# Altium project AVR64DA64-BREAKOUT.PrjPcb
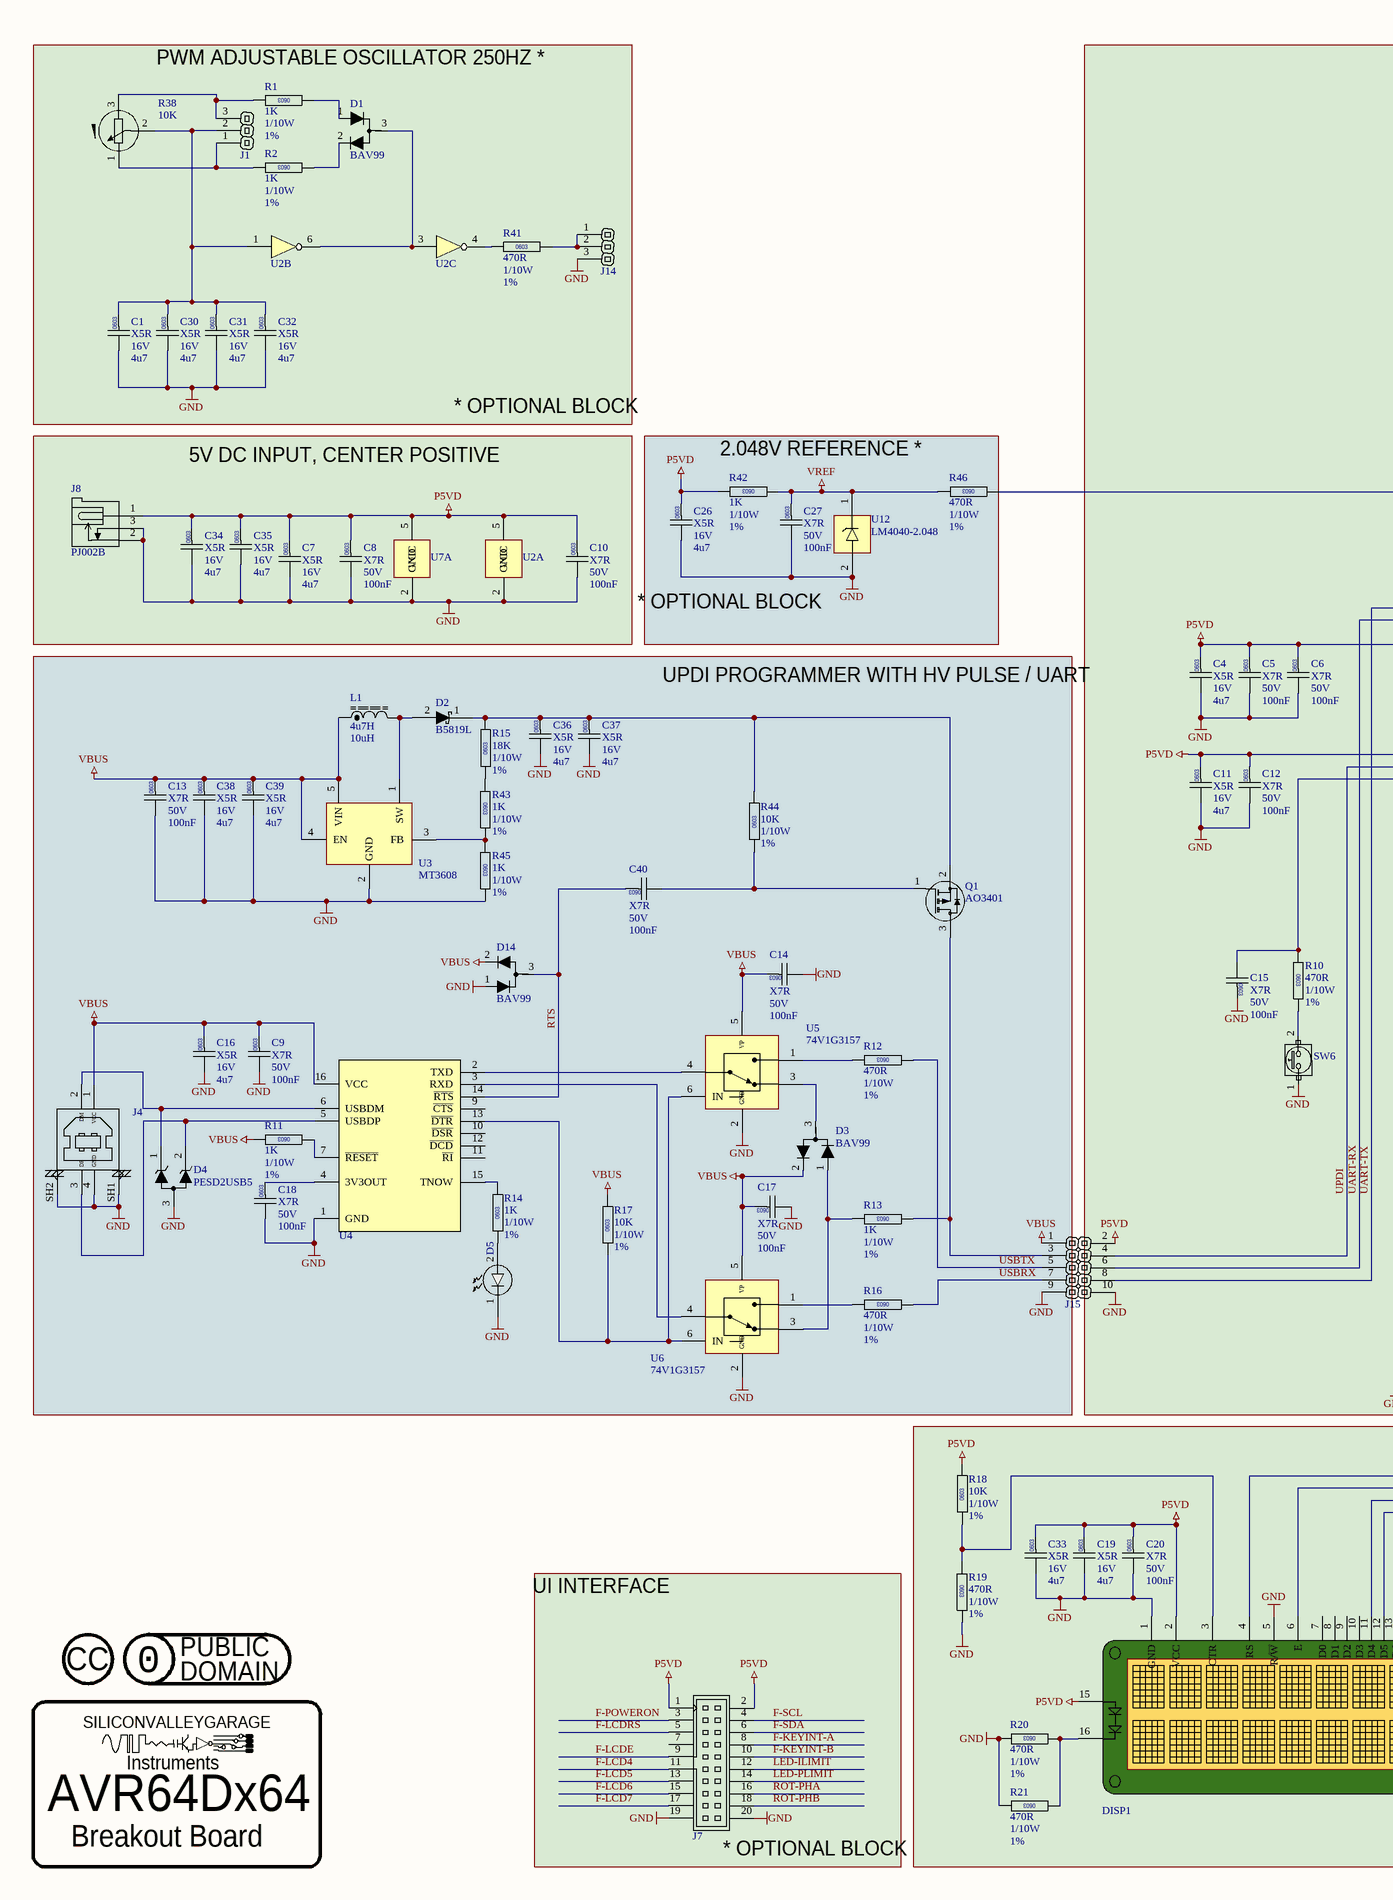
[diagram p0: AVR64DA64-BREAKOUT.SchDoc, left]
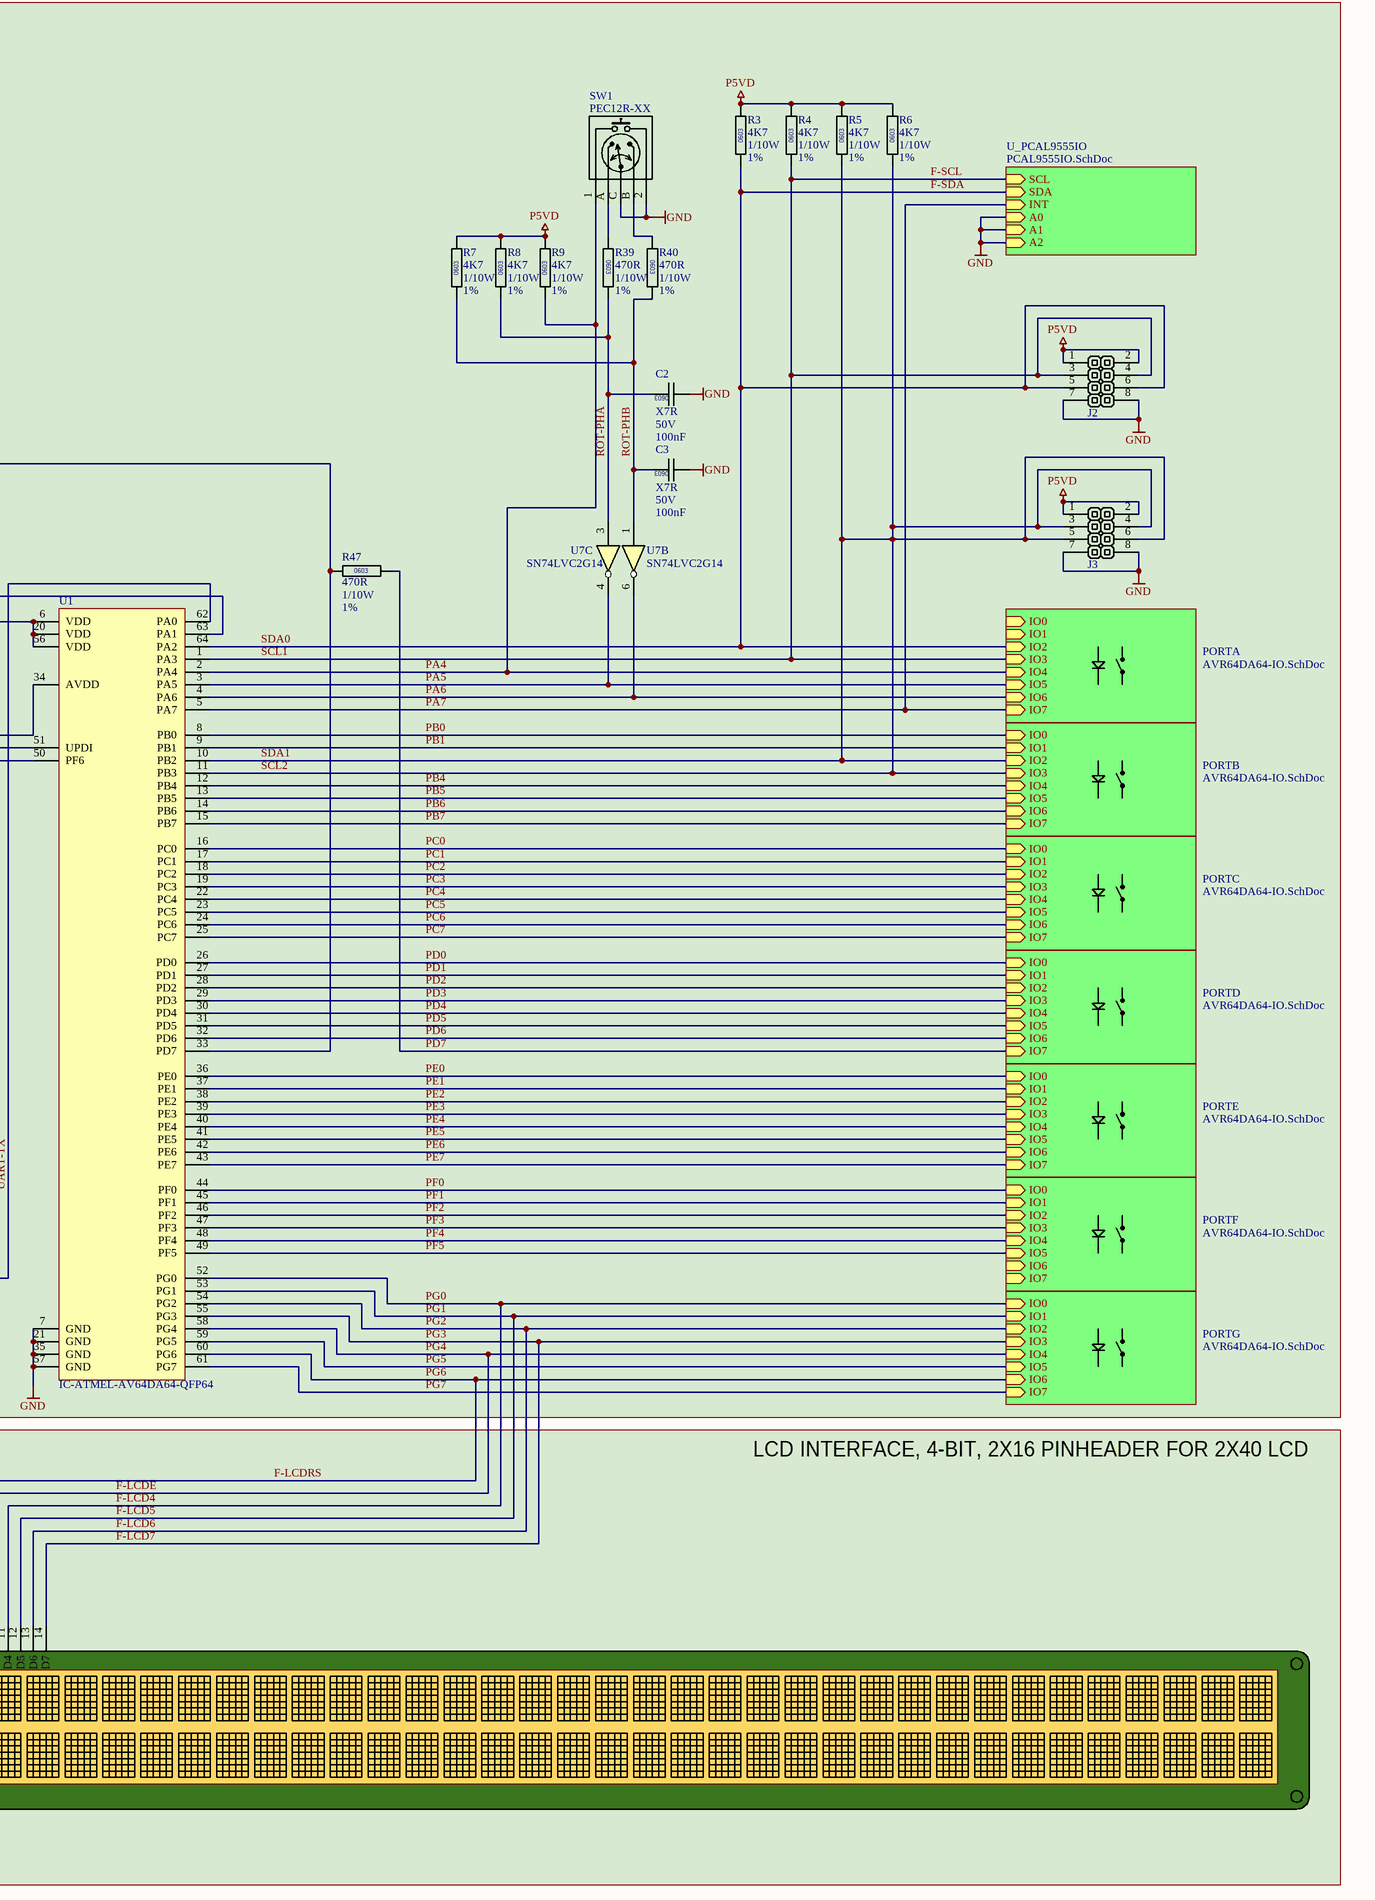
[diagram p1: AVR64DA64-BREAKOUT.SchDoc, right]
SCHdrafter: Vincent Himpe
3 sheets, 461 parts. Net scope: hierarchical (ports join the sheet entries above them; power ports are global).
Board file: AVR64DA64-BREAKOUT.PcbDoc
Sheets:
  AVR64DA64-BREAKOUT.SchDoc
    PORTA = AVR64DA64-IO.SchDoc
    PORTB = AVR64DA64-IO.SchDoc
    PORTC = AVR64DA64-IO.SchDoc
    PORTG = AVR64DA64-IO.SchDoc
    PORTF = AVR64DA64-IO.SchDoc
    PORTD = AVR64DA64-IO.SchDoc
    PORTE = AVR64DA64-IO.SchDoc
    U_PCAL9555IO = PCAL9555IO.SchDoc
      PCAL0 = AVR64DA64-IO.SchDoc
      PCAL1 = AVR64DA64-IO.SchDoc

## Sheet AVR64DA64-BREAKOUT.SchDoc
size A2; SheetNumber: 1; SheetTotal: 3

### Parts
(Parts that share a designator on the sheet are numbered #1, #2 ... from top to bottom, then left to right.)
C1  Dielectric: X5R  Voltage: 16V  Capacitance: 4u7  [CAPC0603]  (hidden comment: CAP0603)
C2  Dielectric: X7R  Voltage: 50V  Capacitance: 100nF  [CAPC0603]  (hidden comment: CAP0603)
C3  Dielectric: X7R  Voltage: 50V  Capacitance: 100nF  [CAPC0603]  (hidden comment: CAP0603)
C4  Dielectric: X5R  Voltage: 16V  Capacitance: 4u7  [CAPC0603]  (hidden comment: CAP0603)
C5  Dielectric: X7R  Voltage: 50V  Capacitance: 100nF  [CAPC0603]  (hidden comment: CAP0603)
C6  Dielectric: X7R  Voltage: 50V  Capacitance: 100nF  [CAPC0603]  (hidden comment: CAP0603)
C7  Dielectric: X5R  Voltage: 16V  Capacitance: 4u7  [CAPC0603]  (hidden comment: CAP0603)
C8  Dielectric: X7R  Voltage: 50V  Capacitance: 100nF  [CAPC0603]  (hidden comment: CAP0603)
C9  Dielectric: X7R  Voltage: 50V  Capacitance: 100nF  [CAPC0603]  (hidden comment: CAP0603)
C10  Dielectric: X7R  Voltage: 50V  Capacitance: 100nF  [CAPC0603]  (hidden comment: CAP0603)
C11  Dielectric: X5R  Voltage: 16V  Capacitance: 4u7  [CAPC0603]  (hidden comment: CAP0603)
C12  Dielectric: X7R  Voltage: 50V  Capacitance: 100nF  [CAPC0603]  (hidden comment: CAP0603)
C13  Dielectric: X7R  Voltage: 50V  Capacitance: 100nF  [CAPC0603]  (hidden comment: CAP0603)
C14  Dielectric: X7R  Voltage: 50V  Capacitance: 100nF  [CAPC0603]  (hidden comment: CAP0603)
C15  Dielectric: X7R  Voltage: 50V  Capacitance: 100nF  [CAPC0603]  (hidden comment: CAP0603)
C16  Dielectric: X5R  Voltage: 16V  Capacitance: 4u7  [CAPC0603]  (hidden comment: CAP0603)
C17  Dielectric: X7R  Voltage: 50V  Capacitance: 100nF  [CAPC0603]  (hidden comment: CAP0603)
C18  Dielectric: X7R  Voltage: 50V  Capacitance: 100nF  [CAPC0603]  (hidden comment: CAP0603)
C19  Dielectric: X5R  Voltage: 16V  Capacitance: 4u7  [CAPC0603]  (hidden comment: CAP0603)
C20  Dielectric: X7R  Voltage: 50V  Capacitance: 100nF  [CAPC0603]  (hidden comment: CAP0603)
C26  Dielectric: X5R  Voltage: 16V  Capacitance: 4u7  [CAPC0603]  (hidden comment: CAP0603)
C27  Dielectric: X7R  Voltage: 50V  Capacitance: 100nF  [CAPC0603]  (hidden comment: CAP0603)
C30  Dielectric: X5R  Voltage: 16V  Capacitance: 4u7  [CAPC0603]  (hidden comment: CAP0603)
C31  Dielectric: X5R  Voltage: 16V  Capacitance: 4u7  [CAPC0603]  (hidden comment: CAP0603)
C32  Dielectric: X5R  Voltage: 16V  Capacitance: 4u7  [CAPC0603]  (hidden comment: CAP0603)
C33  Dielectric: X5R  Voltage: 16V  Capacitance: 4u7  [CAPC0603]  (hidden comment: CAP0603)
C34  Dielectric: X5R  Voltage: 16V  Capacitance: 4u7  [CAPC0603]  (hidden comment: CAP0603)
C35  Dielectric: X5R  Voltage: 16V  Capacitance: 4u7  [CAPC0603]  (hidden comment: CAP0603)
C36  Dielectric: X5R  Voltage: 16V  Capacitance: 4u7  [CAPC0603]  (hidden comment: CAP0603)
C37  Dielectric: X5R  Voltage: 16V  Capacitance: 4u7  [CAPC0603]  (hidden comment: CAP0603)
C38  Dielectric: X5R  Voltage: 16V  Capacitance: 4u7  [CAPC0603]  (hidden comment: CAP0603)
C39  Dielectric: X5R  Voltage: 16V  Capacitance: 4u7  [CAPC0603]  (hidden comment: CAP0603)
C40  Dielectric: X7R  Voltage: 50V  Capacitance: 100nF  [CAPC0603]  (hidden comment: CAP0603)
D1  BAV99  [SOT23]
D2  B5819L  [SOD123]
D3  BAV99  [SOT23]
D4  PESD2USB5  [SOT23]
D5  KT-0603W  [LED-0603-GREEN]  (value not drawn)
D14  BAV99  [SOT23]
DISP1  DISPLAY-LCD-2X40  [CONNECTOR-GENERIC-BOXHEADER-2X8]  (value not drawn)
J1  BOXHEADER-2X4  [HEADER-GENERIC-MALE-1X3]  (value not drawn)
J2  BOXHEADER-2X4  [CONNECTOR-GENERIC-PINHEADER-2X4]  (value not drawn)
J3  BOXHEADER-2X4  [CONNECTOR-GENERIC-PINHEADER-2X4]  (value not drawn)
J4  CONN-CUI-UJ2-BH-BL1-TH  [CONN-CUI-UJ2-BH-BL1-TH]  (value not drawn)
J7  BOXHEADER-10X2  [CONNECTOR GENERIC-BOXHEADER-2X10]  (value not drawn)
J8  PJ002B  [CONN-CUI-PJ-002B]
J14  BOXHEADER-2X4  [HEADER-GENERIC-MALE-1X3]  (value not drawn)
J15  BOXHEADER-3X2  [CONNECTOR-GENERIC-PINHEADER-2X5]  (value not drawn)
L1  10uH  value 4u7H  [CAPC0603]
LOGO?#1  LOGO-LICENSE-CC  [LOGO-LICENSE-CC]  (value not drawn)  (no BOM)
LOGO?#2  LOGO-LICENSE-CC0-PUBLIC  [LOGO-LICENSE-CC0-PUBLIC]  (value not drawn)  (no BOM)
LOGO?#3  LOGO-SILICONVALLEYGARAGE-SMALL  [SILICONVALLEYGARAGE]  (value not drawn)  (graphical)
Q1  AO3401  [SOT23]
R1  value 1K  Power: 1/10W  Tolerance: 1%  [RESC0603]  (hidden comment: RESC0603)
R2  value 1K  Power: 1/10W  Tolerance: 1%  [RESC0603]  (hidden comment: RESC0603)
R3  value 4K7  Power: 1/10W  Tolerance: 1%  [RESC0603]  (hidden comment: RESC0603)
R4  value 4K7  Power: 1/10W  Tolerance: 1%  [RESC0603]  (hidden comment: RESC0603)
R5  value 4K7  Power: 1/10W  Tolerance: 1%  [RESC0603]  (hidden comment: RESC0603)
R6  value 4K7  Power: 1/10W  Tolerance: 1%  [RESC0603]  (hidden comment: RESC0603)
R7  value 4K7  Power: 1/10W  Tolerance: 1%  [RESC0603]  (hidden comment: RESC0603)
R8  value 4K7  Power: 1/10W  Tolerance: 1%  [RESC0603]  (hidden comment: RESC0603)
R9  value 4K7  Power: 1/10W  Tolerance: 1%  [RESC0603]  (hidden comment: RESC0603)
R10  value 470R  Power: 1/10W  Tolerance: 1%  [RESC0603]  (hidden comment: RESC0603)
R11  value 1K  Power: 1/10W  Tolerance: 1%  [RESC0603]  (hidden comment: RESC0603)
R12  value 470R  Power: 1/10W  Tolerance: 1%  [RESC0603]  (hidden comment: RESC0603)
R13  value 1K  Power: 1/10W  Tolerance: 1%  [RESC0603]  (hidden comment: RESC0603)
R14  value 1K  Power: 1/10W  Tolerance: 1%  [RESC0603]  (hidden comment: RESC0603)
R15  value 18K  Power: 1/10W  Tolerance: 1%  [RESC0603]  (hidden comment: RESC0603)
R16  value 470R  Power: 1/10W  Tolerance: 1%  [RESC0603]  (hidden comment: RESC0603)
R17  value 10K  Power: 1/10W  Tolerance: 1%  [RESC0603]  (hidden comment: RESC0603)
R18  value 10K  Power: 1/10W  Tolerance: 1%  [RESC0603]  (hidden comment: RESC0603)
R19  value 470R  Power: 1/10W  Tolerance: 1%  [RESC0603]  (hidden comment: RESC0603)
R20  value 470R  Power: 1/10W  Tolerance: 1%  [RESC0603]  (hidden comment: RESC0603)
R21  value 470R  Power: 1/10W  Tolerance: 1%  [RESC0603]  (hidden comment: RESC0603)
R38  value 10K  [POTMETER-PTV09A-4015F-BXXX]  (hidden comment: POTMETER-PTV09A-4015F-B103)
R39  value 470R  Power: 1/10W  Tolerance: 1%  [RESC0603]  (hidden comment: RESC0603)
R40  value 470R  Power: 1/10W  Tolerance: 1%  [RESC0603]  (hidden comment: RESC0603)
R41  value 470R  Power: 1/10W  Tolerance: 1%  [RESC0603]  (hidden comment: RESC0603)
R42  value 1K  Power: 1/10W  Tolerance: 1%  [RESC0603]  (hidden comment: RESC0603)
R43  value 1K  Power: 1/10W  Tolerance: 1%  [RESC0603]  (hidden comment: RESC0603)
R44  value 10K  Power: 1/10W  Tolerance: 1%  [RESC0603]  (hidden comment: RESC0603)
R45  value 1K  Power: 1/10W  Tolerance: 1%  [RESC0603]  (hidden comment: RESC0603)
R46  value 470R  Power: 1/10W  Tolerance: 1%  [RESC0603]  (hidden comment: RESC0603)
R47  value 470R  Power: 1/10W  Tolerance: 1%  [RESC0603]  (hidden comment: RESC0603)
SW1  PEC12R-XX  [SWITCH-BOURNS-PEC12R-4120F-S0012]
SW6  SWITCH-XUNPU-TS-1088-AR02016  [SWITCH-XUNPU-TS-1088-AR02016]  (value not drawn)
U1  IC-ATMEL-AV64DA64-QFP64  [QFP50P1000X1000X100-64N]
U2  IC-TI-SN74LVC2G14  [SOT23-6]  (value not drawn)  (parts A,B,C of 3)
U3  MT3608  [SOT23-6]
U4  CP2102  [SO127P600-16N]  (value not drawn)
U5  74V1G3157  [SOT23-6]
U6  74V1G3157  [SOT23-6]
U7  IC-TI-SN74LVC2G14  [SOT23-6]  (value not drawn)  (parts A,B,C of 3)
U12  LM4040-2.048  [SOT23]

### Blocks framed on the sheet
5V DC INPUT, CENTER POSITIVE: C7 C8 C10 C34 C35 J8 U2 U7
UPDI PROGRAMMER WITH HV PULSE / UART: C9 C13 C14 C16-C18 C36-C40 D2-D5 D14 J4 L1 Q1 R11-R17 R43-R45 U3-U6
LCD INTERFACE, 4-BIT, 2X16 PINHEADER FOR 2X40 LCD: C19 C20 C33 DISP1 R18-R21
AVR64Dx64: LOGO?#3

### Sub-sheets
PORTA = AVR64DA64-IO.SchDoc: IO0 (in), IO1 (in), IO2 (in), IO3 (in), IO4 (in), IO5 (in), IO6 (in), IO7 (in)
PORTB = AVR64DA64-IO.SchDoc: IO0 (in), IO1 (in), IO2 (in), IO3 (in), IO4 (in), IO5 (in), IO6 (in), IO7 (in)
PORTC = AVR64DA64-IO.SchDoc: IO0 (in), IO1 (in), IO2 (in), IO3 (in), IO4 (in), IO5 (in), IO6 (in), IO7 (in)
PORTD = AVR64DA64-IO.SchDoc: IO0 (in), IO1 (in), IO2 (in), IO3 (in), IO4 (in), IO5 (in), IO6 (in), IO7 (in)
PORTE = AVR64DA64-IO.SchDoc: IO0 (in), IO1 (in), IO2 (in), IO3 (in), IO4 (in), IO5 (in), IO6 (in), IO7 (in)
PORTF = AVR64DA64-IO.SchDoc: IO0 (in), IO1 (in), IO2 (in), IO3 (in), IO4 (in), IO5 (in), IO6 (in), IO7 (in)
PORTG = AVR64DA64-IO.SchDoc: IO0 (in), IO1 (in), IO2 (in), IO3 (in), IO4 (in), IO5 (in), IO6 (in), IO7 (in)
U_PCAL9555IO = PCAL9555IO.SchDoc: SCL (in), SDA (in), INT (in), A0 (in), A1 (in), A2 (in)

### Nets
GND: C1.2 C2.2 C3.2 C4.2 C5.2 C6.2 C7.2 C8.2 C9.2 C10.2 C11.2 C12.2 C13.2 C14.2 C15.1 C16.2 C17.2 C18.2 C19.2 C20.2 C26.2 C27.2 C30.2 C31.2 C32.2 C33.2 C34.2 C35.2 C36.2 C37.2 C38.2 C39.2 D4.3(A) D5.1(A) D14.1(K) DISP1.1(GND) DISP1.5(R/~{W}) J2.7(-) J2.8(-) J3.7(-) J3.8(-) J4.4(GND) J4.SH1(NO) J4.SH2(NO) J7.19(-) J7.20(-) J8.2 J8.3 J14.3(-) J15.9(-) J15.10(-) R19.1 R20.1 R21.1 R45.1 SW1.2 SW1.C SW6.1 U1.7(GND) U1.21(GND) U1.35(GND) U1.57(GND) U2.2(GND) U3.2(GND) U4.1(GND) U5.2(GND) U6.2(GND) U7.2(GND) U12.2 ; sheet U_PCAL9555IO/A0, sheet U_PCAL9555IO/A1, sheet U_PCAL9555IO/A2
P5VD: C4.1 C5.1 C6.1 C7.1 C8.1 C10.1 C11.1 C12.1 C19.1 C20.1 C26.1 C33.1 C34.1 C35.1 DISP1.2(VCC) DISP1.15(LED+) J2.1(+) J2.2(-) J3.1(+) J3.2(-) J7.1(+) J7.2(-) J8.1 J15.2(-) R3.1 R4.1 R5.1 R6.1 R7.1 R8.1 R9.1 R18.1 R42.1 U1.6(VDD) U1.20(VDD) U1.34(AVDD) U1.56(VDD) U2.5(VCC) U7.5(VCC)
VBUS: C9.1 C13.1 C14.1 C16.1 C17.1 C38.1 C39.1 D3.2(A) D14.2(A) J4.1(VCC) J15.1(+) L1.1 R11.1 R17.1 U3.4(EN) U3.5(VIN) U4.16(VCC) U5.5(VP) U6.5(VP)
VREF: C27.1 R42.2 R46.1 U12.1
F-KEYINT-A: J7.8(-)
F-KEYINT-B: J7.10(-)
F-LCD4: DISP1.11(D4) J7.11(-) U1.52(PG0) ; sheet PORTG/IO0  [also labelled PG0]
F-LCD5: DISP1.12(D5) J7.13(-) U1.53(PG1) ; sheet PORTG/IO1  [also labelled PG1]
F-LCD6: DISP1.13(D6) J7.15(-) U1.54(PG2) ; sheet PORTG/IO2  [also labelled PG2]
F-LCD7: DISP1.14(D7) J7.17(-) U1.55(PG3) ; sheet PORTG/IO3  [also labelled PG3]
F-LCDE: DISP1.6(E) J7.9(-) U1.58(PG4) ; sheet PORTG/IO4  [also labelled PG4]
F-LCDRS: DISP1.4(RS) J7.5(-) U1.60(PG6) ; sheet PORTG/IO6  [also labelled PG6]
F-POWERON: J7.3(-)
F-SCL: J2.3(-) J2.4(-) J7.4(-) R4.2 U1.1(PA3) ; sheet PORTA/IO3, sheet U_PCAL9555IO/SCL  [also labelled SCL1]
F-SDA: J2.5(-) J2.6(-) J7.6(-) R3.2 U1.64(PA2) ; sheet PORTA/IO2, sheet U_PCAL9555IO/SDA  [also labelled SDA0]
LED-ILIMIT: J7.12(-)
LED-PLIMIT: J7.14(-)
PA4: R9.2 SW1.1 U1.2(PA4) ; sheet PORTA/IO4
PA5: U1.3(PA5) U7.4 ; sheet PORTA/IO5
PA6: U1.4(PA6) U7.6 ; sheet PORTA/IO6
PA7: U1.5(PA7) ; sheet PORTA/IO7, sheet U_PCAL9555IO/INT
PB0: U1.8(PB0) ; sheet PORTB/IO0
PB1: U1.9(PB1) ; sheet PORTB/IO1
PB4: U1.12(PB4) ; sheet PORTB/IO4
PB5: U1.13(PB5) ; sheet PORTB/IO5
PB6: U1.14(PB6) ; sheet PORTB/IO6
PB7: U1.15(PB7) ; sheet PORTB/IO7
PC0: U1.16(PC0) ; sheet PORTC/IO0
PC1: U1.17(PC1) ; sheet PORTC/IO1
PC2: U1.18(PC2) ; sheet PORTC/IO2
PC3: U1.19(PC3) ; sheet PORTC/IO3
PC4: U1.22(PC4) ; sheet PORTC/IO4
PC5: U1.23(PC5) ; sheet PORTC/IO5
PC6: U1.24(PC6) ; sheet PORTC/IO6
PC7: U1.25(PC7) ; sheet PORTC/IO7
PD0: U1.26(PD0) ; sheet PORTD/IO0
PD1: U1.27(PD1) ; sheet PORTD/IO1
PD2: U1.28(PD2) ; sheet PORTD/IO2
PD3: U1.29(PD3) ; sheet PORTD/IO3
PD4: U1.30(PD4) ; sheet PORTD/IO4
PD5: U1.31(PD5) ; sheet PORTD/IO5
PD6: U1.32(PD6) ; sheet PORTD/IO6
PD7: R47.1 ; sheet PORTD/IO7
PE0: U1.36(PE0) ; sheet PORTE/IO0
PE1: U1.37(PE1) ; sheet PORTE/IO1
PE2: U1.38(PE2) ; sheet PORTE/IO2
PE3: U1.39(PE3) ; sheet PORTE/IO3
PE4: U1.40(PE4) ; sheet PORTE/IO4
PE5: U1.41(PE5) ; sheet PORTE/IO5
PE6: U1.42(PE6) ; sheet PORTE/IO6
PE7: U1.43(PE7) ; sheet PORTE/IO7
PF0: U1.44(PF0) ; sheet PORTF/IO0
PF1: U1.45(PF1) ; sheet PORTF/IO1
PF2: U1.46(PF2) ; sheet PORTF/IO2
PF3: U1.47(PF3) ; sheet PORTF/IO3
PF4: U1.48(PF4) ; sheet PORTF/IO4
PF5: U1.49(PF5) ; sheet PORTF/IO5
PG5: U1.59(PG5) ; sheet PORTG/IO5
PG7: U1.61(PG7) ; sheet PORTG/IO7
ROT-PHA: C2.1 J7.16(-) R8.2 R39.1 U7.3
ROT-PHB: C3.1 J7.18(-) R7.2 R40.1 U7.1
RTS: C40.1 D14.3(A) U4.14(~{RTS})
SCL2: J3.3(-) J3.4(-) J3.5(-) J3.6(-) R5.2 R6.2 U1.10(PB2) U1.11(PB3) ; sheet PORTB/IO2, sheet PORTB/IO3  [also labelled SDA1]
UART-RX: J15.6(-) U1.63(PA1)
UART-TX: J15.8(-) U1.62(PA0)
UPDI: J15.4(-) U1.51(UPDI)
USBRX: J15.7(-) R16.2
USBTX: J15.5(-) R12.2
NetC1_1: C1.1 C30.1 C31.1 C32.1 J1.2(-) R38.2 U2.1
NetC15_2: C15.2 R10.2 U1.50(PF6)
NetC18_1: C18.1 U4.4(3V3OUT)
NetC36_1: C36.1 C37.1 D2.1(A) Q1.2(S) R15.1 R44.1
NetC40_2: C40.2 Q1.1(G1) R44.2
NetD1_1: D1.1(K) R1.2
NetD1_2: D1.2(A) R2.2
NetD1_3: D1.3(A) U2.3 U2.6
NetD2_2: D2.2(K) L1.2 U3.1(SW)
NetD3_1: D3.1(K) R13.1 U6.3(B1)
NetD3_3: D3.3(A) U5.3(B1)
NetD4_1: D4.1(K) J4.2(DM) U4.6(USBDM)
NetD4_2: D4.2(A) J4.3(DP) U4.5(USBDP)
NetD5_2: D5.2(K) R14.2
NetDISP1_3: DISP1.3(CTR) R18.2 R19.2
NetDISP1_16: DISP1.16(LED-) R20.2 R21.2
NetJ1_1: J1.1(+) R2.1 R38.1
NetJ1_3: J1.3(-) R1.1 R38.3
NetJ14_1: J14.1(+) J14.2(-) R41.1
NetJ15_3: J15.3(-) Q1.3(D) R13.2
NetR10_1: R10.1 SW6.2
NetR11_2: R11.2 U4.7(~{RESET})
NetR12_1: R12.1 U5.1(NO)
NetR14_1: R14.1 U4.15(TNOW)
NetR15_2: R15.2 R43.2
NetR16_1: R16.1 U6.1(NO)
NetR17_2: R17.2 U4.13(~{DTR}) U5.6(IN) U6.6(IN)
NetR39_2: R39.2 SW1.A
NetR40_2: R40.2 SW1.B
NetR41_2: R41.2 U2.4
NetR43_1: R43.1 R45.2 U3.3(FB)
NetR46_2: R46.2 R47.2 U1.33(PD7)
NetU4_2: U4.2(TXD) U5.4(COM)
NetU4_3: U4.3(RXD) U6.4(COM)

Not connected (* = marked no-connect by the designer): DISP1 7(D0) 8(D1) 9(D2) 10(D3); J7 7(-); U4 9(~{CTS}) 10(~{DSR}) 11(~{RI}) 12(~{DCD})

### Notes on the sheet
- PWM ADJUSTABLE OSCILLATOR 250HZ *
- * OPTIONAL BLOCK
- 2.048V REFERENCE *
- UI INTERFACE
- (near LOGO?#3) Instruments
- Breakout Board
- (near J7) * OPTIONAL BLOCK
- (in symbol LOGO-LICENSE-CC) CC
- (in symbol LOGO-LICENSE-CC0-PUBLIC) PUBLIC; 0; DOMAIN
- (in symbol LOGO-SILICONVALLEYGARAGE-SMALL) SILICONVALLEYGARAGE
- (in symbol RESC-0603-1K-1%-1/10W) 0603
- (in symbol RESC-0603-4K7-1%-1/10W) 0603
- (in symbol RESC-0603-10K-1%-1/10W) 0603
- (in symbol RESC-0603-18K-1%-1/10W) 0603
- (in symbol RESC-0603-470R-1%-1/10W) 0603

### Library data of the parts
C1 C4 C7 C11 C16 C19 C26 C30-C39 = CAPC-0603-4u7-10V-X5R_1: CAPACITOR,CERAMIC,4u7,16V,X5R,0603; Package / Case: 0603; Location: *; LCSC: C19666
C2 C3 C5 C6 C8-C10 C12-C15 C17 C18 C20 C27 C40 = CAPC-0603-100nF-50V-X7R: CAPACITOR,CERAMIC,100nF,50V,X7R,0603; Manufacturer 1: KEMET; Manufacturer Part Number 1: C0603C104K5RACTU; Package / Case: 0603; Location: *; LCSC: C14663; MOUSER: 80-C0603C104K5R
D1 D3 D14 = DIODE-DIODES-BAV99: DIODE,75V,215mA,SOT23,LOW LEAKAGE; LCSC: C2500
D2 = DIODE-SCHOTTKY-ONSEMI-B5819L: DIODE,SCHOTTKY,40V,1,B5819,SOD123; Manufacturer 1: JIANGSU CHANGJING; Manufacturer Part Number 1: B5819W SL; LCSC: C8598
D4 = TVS-NEXPERIA-PESD2USB5UX-TR: DIODE,TVS,DUAL,NIDIRETIONAL,USB,PESD2USB5UX-TR,SOT23; DIGIKEY: 1727-PESD2USB5UX-CT-ND; LCSC: C3709087; Manufacturer 1: NEXPERIA; Manufacturer Part Number 1: PESD2USB5UX-TR
D5 = LED-0603-WHITE: LED,SMD,WHITE,42mCd,0603; Manufacturer 1: Hubei KENTO Elec; LCSC: C2290; Manufacturer Part Number 1: KT-0603W
DISP1 = DISPLAY-LCD-2X40: DISPLAY,LCD,ALPHA,2X40CHAR,HD44780,YELLOW BL; LCSC: C429960
J1 J14 = CONN-HEADER-MALE-1x3: CONN,HEADER,1x3,2.54mm; LCSC: C429954
J2 J3 = CONN-HEADER-MALE-2X4: CONN,HEADER,2X4,2.54mm; LCSC: C42431809
J4 = CONN-CUI-UJ2-BH-BL1-TH: CONN,USB2.0,B,RA,BLUE; LCSC: C720549
J7 = CONN-BOXHEADER-10X2: LCSC: C429961
J8 = CONN-CUI-PJ002B: CONN,DCPOWER,BARREL,CUI,PJ002B
J15 = CONN-HEADER-MALE-2X5: CONN,HEADER,2X5,2.54mm; LCSC: C42431802
L1 = IND-MURATA-LQM18PN4R7MFRL: IND,4u7H,0.6A,0603, LLQM18PN4R7MFRL; Manufacturer 1: MURATA; LCSC: C114862; Manufacturer Part Number 1: LLQM18PN4R7MFRL; MOUSER: 81-LQH3NPZ100MMEL
LOGO?#3 = LOGO-SILICONVALLEYGARAGE-SMALL: LOGO,SILICONVALLEYGARAGE,SMALL
Q1 = XSTR-PMOS-ALPHAOMEGA-AO3401: XSTR,PMOS,30V,4A,AO3401,SOT23; Manufacturer Part Number 1: AO3401A; Package: DPAK; Vds: 30V; Idmax: 4A; LCSC: C15127; Manufacturer 1: ALPHA OMEGA
R1 R2 R11 R13 R14 R42 R43 R45 = RESC-0603-1K-1%-1/10W: RESISTOR,1K,1%,100mW,0603 (1608); Manufacturer 1: YAGEO; Manufacturer Part Number 1: RC0603FR-071KL; Location: *; LCSC: C21190; MOUSER: 603-RC0603FR-071KL
R3-R9 = RESC-0603-4K7-1%-1/10W: RESISTOR,4K7,1%,100mW,0603 (1608); Manufacturer 1: YAGEO; Manufacturer Part Number 1: RC0603FR-074K7L; Location: *; LCSC: C23162; MOUSER: 603-RC0603FR-074K7L
R10 R12 R16 R19-R21 R39-R41 R46 R47 = RESC-0603-470R-1%-1/10W: RESISTOR,470R,1%,100mW,0603 (1608); Location: *; LCSC: C23179
R15 = RESC-0603-18K-1%-1/10W: RESISTOR,18K,1%,100mW,0603 (1608); Location: *; LCSC: C25810
R17 R18 R44 = RESC-0603-10K-1%-1/10W: RESISTOR,10K,1%,100mW,0603 (1608); Manufacturer 1: YAGEO; Manufacturer Part Number 1: RC0603FR-0710KL; Location: *; LCSC: C25804; MOUSER: 603-RC0603FR-0710KL
R38 = POTMETER-PTV09A-4015F-B103: RES,POT,VERT,TH,BOURNS PTV09A-4015F,10K
SW1 = SWITCH-BOURNS-PEC12R-4120F-S0012: SWITCH,ENCODER+CLICK,BOURNS,PEC12R-4120F-S0012; Manufacturer 1: BOURNS; Manufacturer Part Number 1: PEC12R-4120F-S0012
SW6 = SWITCH-XUNPU-TS-1088-AR02016: SWITCH,TACT,SMD,2PIN,SMT,TOP ACTUATOR; Manufacturer 1: XUNPU; LCSC: C720477; Manufacturer Part Number 1: TS-1088-AR02016
U1 = IC-ATMEL-AV64DA64-QFP64: IC,CPU,ATMEL,AVR64DA64,TQFP64; LCSC: C5227841
U2 U7 = IC-TI-SN74LVC2G14: IC,LOGIC,SINGLEGATE,DUAL SCHMITT-TRIGER,INVERTER,SOT23-6; Manufacturer Part Number 1: 74LVC2G14GV; LCSC: C19829598
U3 = IC-AEROSEMI-MT3608: IC,REG,BOOST,AEROSEMI,MT3608; LCSC: C84817
U4 = IC-WCH-CH340B: IC,XCVR,USB UART WITH XTAL AND EEPROM,WCH,CH340G-SO16; Manufacturer Part Number 1: FT231XS-R; LCSC: CH340B; Manufacturer 1: WCH; MOUSER: CH340B
U5 U6 = IC-TI-SN74LVC1G3157DBVR: IC,ANALOG,SPDT ANALOG SWITCH,SINGLEGATE,TI,SN74LVC1G3157DBVR,SOT23-6; LCSC: C2673494; DIGIKEY: 296-14908-1-ND; Manufacturer 1: TI; Manufacturer Part Number 1: SN74LVC1G3157DBVR
U12 = IC-TI-LM4040-2.048: IC,VOLTAGE REFERENCE,2.048V; Manufacturer 1: TI; Manufacturer Part Number 1: LM4040A20IDBZR; LCSC: C2156884

## Sheet AVR64DA64-IO.SchDoc
size A4; SheetNumber: 2; SheetTotal: 3
Used 9 times, as channels PORTA, PORTB, PORTC, PORTG, PORTF, PORTD, PORTE, U_PCAL9555IO/PCAL0, U_PCAL9555IO/PCAL1. Parts and nets are listed once, with the designators drawn on the sheet.
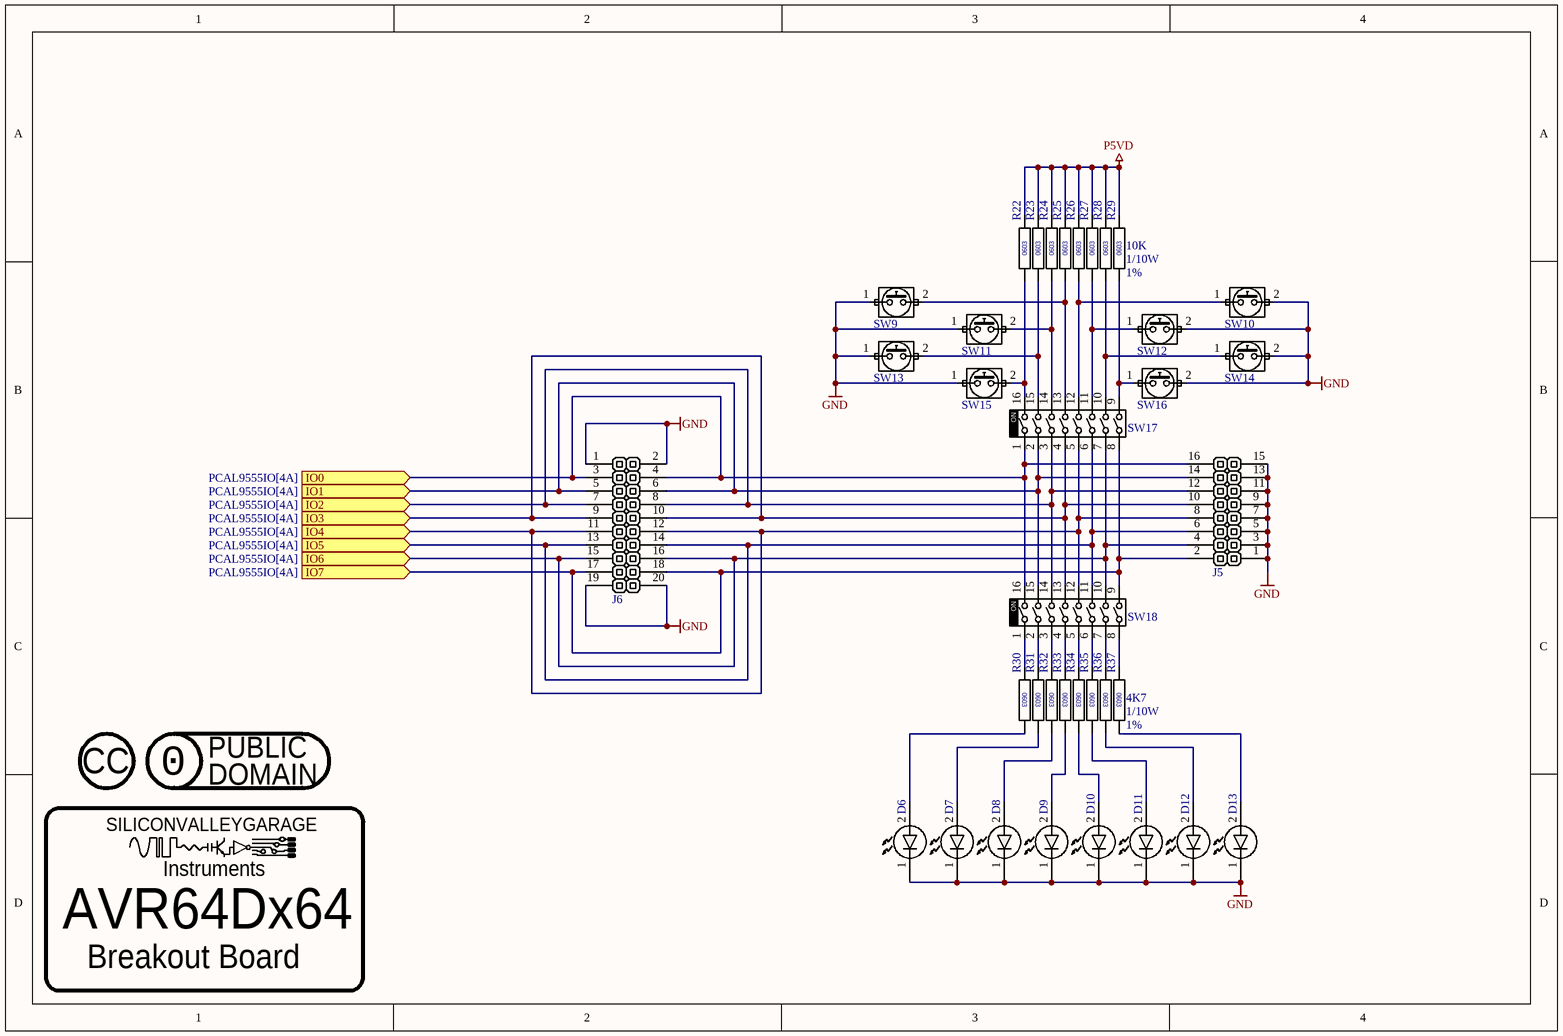
[diagram p2: AVR64DA64-IO.SchDoc]

### Parts
(Parts that share a designator on the sheet are numbered #1, #2 ... from top to bottom, then left to right.)
D6  KT-0603W  [LED-0603-GREEN]  (value not drawn)
D7  KT-0603W  [LED-0603-GREEN]  (value not drawn)
D8  KT-0603W  [LED-0603-GREEN]  (value not drawn)
D9  KT-0603W  [LED-0603-GREEN]  (value not drawn)
D10  KT-0603W  [LED-0603-GREEN]  (value not drawn)
D11  KT-0603W  [LED-0603-GREEN]  (value not drawn)
D12  KT-0603W  [LED-0603-GREEN]  (value not drawn)
D13  KT-0603W  [LED-0603-GREEN]  (value not drawn)
J5  BOXHEADER-3X2  [CONNECTOR-GENERIC-PINHEADER-2X8]  (value not drawn)
J6  BOXHEADER-3X2  [CONNECTOR-GENERIC-PINHEADER-2X10]  (value not drawn)
LOGO?#1  LOGO-LICENSE-CC  [LOGO-LICENSE-CC]  (value not drawn)  (no BOM)
LOGO?#2  LOGO-LICENSE-CC0-PUBLIC  [LOGO-LICENSE-CC0-PUBLIC]  (value not drawn)  (no BOM)
LOGO?#3  LOGO-SILICONVALLEYGARAGE-SMALL  [SILICONVALLEYGARAGE]  (value not drawn)  (graphical)
R22  RESC0603  [RESC0603]  (value not drawn)
R23  RESC0603  [RESC0603]  (value not drawn)
R24  RESC0603  [RESC0603]  (value not drawn)
R25  RESC0603  [RESC0603]  (value not drawn)
R26  RESC0603  [RESC0603]  (value not drawn)
R27  RESC0603  [RESC0603]  (value not drawn)
R28  RESC0603  [RESC0603]  (value not drawn)
R29  value 10K  Power: 1/10W  Tolerance: 1%  [RESC0603]  (hidden comment: RESC0603)
R30  RESC0603  [RESC0603]  (value not drawn)
R31  RESC0603  [RESC0603]  (value not drawn)
R32  RESC0603  [RESC0603]  (value not drawn)
R33  RESC0603  [RESC0603]  (value not drawn)
R34  RESC0603  [RESC0603]  (value not drawn)
R35  RESC0603  [RESC0603]  (value not drawn)
R36  RESC0603  [RESC0603]  (value not drawn)
R37  value 4K7  Power: 1/10W  Tolerance: 1%  [RESC0603]  (hidden comment: RESC0603)
SW9  SWITCH-XUNPU-TS-1088-AR02016  [SWITCH-XUNPU-TS-1088-AR02016]  (value not drawn)
SW10  SWITCH-XUNPU-TS-1088-AR02016  [SWITCH-XUNPU-TS-1088-AR02016]  (value not drawn)
SW11  SWITCH-XUNPU-TS-1088-AR02016  [SWITCH-XUNPU-TS-1088-AR02016]  (value not drawn)
SW12  SWITCH-XUNPU-TS-1088-AR02016  [SWITCH-XUNPU-TS-1088-AR02016]  (value not drawn)
SW13  SWITCH-XUNPU-TS-1088-AR02016  [SWITCH-XUNPU-TS-1088-AR02016]  (value not drawn)
SW14  SWITCH-XUNPU-TS-1088-AR02016  [SWITCH-XUNPU-TS-1088-AR02016]  (value not drawn)
SW15  SWITCH-XUNPU-TS-1088-AR02016  [SWITCH-XUNPU-TS-1088-AR02016]  (value not drawn)
SW16  SWITCH-XUNPU-TS-1088-AR02016  [SWITCH-XUNPU-TS-1088-AR02016]  (value not drawn)
SW17  SWITCH-DIP-NOX8-SMT-2.54  [SWITCH-CTS-219-8MST]  (value not drawn)
SW18  SWITCH-DIP-NOX8-SMT-2.54  [SWITCH-CTS-219-8MST]  (value not drawn)

### Blocks framed on the sheet
AVR64Dx64: LOGO?#3

### Ports
IO0 (in, see PCAL9555IO[4A]), IO1 (in, see PCAL9555IO[4A]), IO2 (in, see PCAL9555IO[4A]), IO3 (in, see PCAL9555IO[4A]), IO4 (in, see PCAL9555IO[4A]), IO5 (in, see PCAL9555IO[4A]), IO6 (in, see PCAL9555IO[4A]), IO7 (in, see PCAL9555IO[4A])

### Nets
GND: D6.1(A) D7.1(A) D8.1(A) D9.1(A) D10.1(A) D11.1(A) D12.1(A) D13.1(A) J5.1(+) J5.3(-) J5.5(-) J5.7(-) J5.9(-) J5.11(-) J5.13(-) J5.15(-) J6.1(+) J6.2(-) J6.19(-) J6.20(-) SW9.1 SW10.2 SW11.1 SW12.2 SW13.1 SW14.2 SW15.1 SW16.2
P5VD: R22.1 R23.1 R24.1 R25.1 R26.1 R27.1 R28.1 R29.1
IO0: J5.16(-) J6.3(-) J6.4(-) SW17.1 SW18.16 ; port IO0
IO1: J5.14(-) J6.5(-) J6.6(-) SW17.2 SW18.15 ; port IO1
IO2: J5.12(-) J6.7(-) J6.8(-) SW17.3 SW18.14 ; port IO2
IO3: J5.10(-) J6.9(-) J6.10(-) SW17.4 SW18.13 ; port IO3
IO4: J5.8(-) J6.11(-) J6.12(-) SW17.5 SW18.12 ; port IO4
IO5: J5.6(-) J6.13(-) J6.14(-) SW17.6 SW18.11 ; port IO5
IO6: J5.4(-) J6.15(-) J6.16(-) SW17.7 SW18.10 ; port IO6
IO7: J5.2(-) J6.17(-) J6.18(-) SW17.8 SW18.9 ; port IO7
NetD6_2: D6.2(K) R30.1
NetD7_2: D7.2(K) R31.1
NetD8_2: D8.2(K) R32.1
NetD9_2: D9.2(K) R33.1
NetD10_2: D10.2(K) R34.1
NetD11_2: D11.2(K) R35.1
NetD12_2: D12.2(K) R36.1
NetD13_2: D13.2(K) R37.1
NetR22_2: R22.2 SW15.2 SW17.16
NetR23_2: R23.2 SW13.2 SW17.15
NetR24_2: R24.2 SW11.2 SW17.14
NetR25_2: R25.2 SW9.2 SW17.13
NetR26_2: R26.2 SW10.1 SW17.12
NetR27_2: R27.2 SW12.1 SW17.11
NetR28_2: R28.2 SW14.1 SW17.10
NetR29_2: R29.2 SW16.1 SW17.9
NetR30_2: R30.2 SW18.1
NetR31_2: R31.2 SW18.2
NetR32_2: R32.2 SW18.3
NetR33_2: R33.2 SW18.4
NetR34_2: R34.2 SW18.5
NetR35_2: R35.2 SW18.6
NetR36_2: R36.2 SW18.7
NetR37_2: R37.2 SW18.8

### Channels
PORTA: designators D6=D6_PORTA D7=D7_PORTA D8=D8_PORTA D9=D9_PORTA D10=D10_PORTA D11=D11_PORTA D12=D12_PORTA D13=D13_PORTA J5=J5_PORTA J6=J6_PORTA LOGO?=LOGO?_PORTA#2 LOGO?=LOGO?_PORTA#1 LOGO?=LOGO?_PORTA#3 R22=R22_PORTA R23=R23_PORTA R24=R24_PORTA R25=R25_PORTA R26=R26_PORTA R27=R27_PORTA R28=R28_PORTA R29=R29_PORTA R30=R30_PORTA R31=R31_PORTA R32=R32_PORTA R33=R33_PORTA R34=R34_PORTA R35=R35_PORTA R36=R36_PORTA R37=R37_PORTA SW9=SW9_PORTA SW10=SW10_PORTA SW11=SW11_PORTA SW12=SW12_PORTA SW13=SW13_PORTA SW14=SW14_PORTA SW15=SW15_PORTA SW16=SW16_PORTA SW17=SW17_PORTA SW18=SW18_PORTA; ports IO0=IO0_PORTA IO1=IO1_PORTA IO2=F-SDA IO3=F-SCL IO4=PA4 IO5=PA5 IO6=PA6 IO7=PA7
PORTB: designators D6=D6_PORTB D7=D7_PORTB D8=D8_PORTB D9=D9_PORTB D10=D10_PORTB D11=D11_PORTB D12=D12_PORTB D13=D13_PORTB J5=J5_PORTB J6=J6_PORTB LOGO?=LOGO?_PORTB#2 LOGO?=LOGO?_PORTB#1 LOGO?=LOGO?_PORTB#3 R22=R22_PORTB R23=R23_PORTB R24=R24_PORTB R25=R25_PORTB R26=R26_PORTB R27=R27_PORTB R28=R28_PORTB R29=R29_PORTB R30=R30_PORTB R31=R31_PORTB R32=R32_PORTB R33=R33_PORTB R34=R34_PORTB R35=R35_PORTB R36=R36_PORTB R37=R37_PORTB SW9=SW9_PORTB SW10=SW10_PORTB SW11=SW11_PORTB SW12=SW12_PORTB SW13=SW13_PORTB SW14=SW14_PORTB SW15=SW15_PORTB SW16=SW16_PORTB SW17=SW17_PORTB SW18=SW18_PORTB; ports IO0=PB0 IO1=PB1 IO2=SCL2 IO3=SCL2 IO4=PB4 IO5=PB5 IO6=PB6 IO7=PB7
PORTC: designators D6=D6_PORTC D7=D7_PORTC D8=D8_PORTC D9=D9_PORTC D10=D10_PORTC D11=D11_PORTC D12=D12_PORTC D13=D13_PORTC J5=J5_PORTC J6=J6_PORTC LOGO?=LOGO?_PORTC#2 LOGO?=LOGO?_PORTC#1 LOGO?=LOGO?_PORTC#3 R22=R22_PORTC R23=R23_PORTC R24=R24_PORTC R25=R25_PORTC R26=R26_PORTC R27=R27_PORTC R28=R28_PORTC R29=R29_PORTC R30=R30_PORTC R31=R31_PORTC R32=R32_PORTC R33=R33_PORTC R34=R34_PORTC R35=R35_PORTC R36=R36_PORTC R37=R37_PORTC SW9=SW9_PORTC SW10=SW10_PORTC SW11=SW11_PORTC SW12=SW12_PORTC SW13=SW13_PORTC SW14=SW14_PORTC SW15=SW15_PORTC SW16=SW16_PORTC SW17=SW17_PORTC SW18=SW18_PORTC; ports IO0=PC0 IO1=PC1 IO2=PC2 IO3=PC3 IO4=PC4 IO5=PC5 IO6=PC6 IO7=PC7
PORTG: designators D6=D6_PORTG D7=D7_PORTG D8=D8_PORTG D9=D9_PORTG D10=D10_PORTG D11=D11_PORTG D12=D12_PORTG D13=D13_PORTG J5=J5_PORTG J6=J6_PORTG LOGO?=LOGO?_PORTG#2 LOGO?=LOGO?_PORTG#1 LOGO?=LOGO?_PORTG#3 R22=R22_PORTG R23=R23_PORTG R24=R24_PORTG R25=R25_PORTG R26=R26_PORTG R27=R27_PORTG R28=R28_PORTG R29=R29_PORTG R30=R30_PORTG R31=R31_PORTG R32=R32_PORTG R33=R33_PORTG R34=R34_PORTG R35=R35_PORTG R36=R36_PORTG R37=R37_PORTG SW9=SW9_PORTG SW10=SW10_PORTG SW11=SW11_PORTG SW12=SW12_PORTG SW13=SW13_PORTG SW14=SW14_PORTG SW15=SW15_PORTG SW16=SW16_PORTG SW17=SW17_PORTG SW18=SW18_PORTG; ports IO0=F-LCD4 IO1=F-LCD5 IO2=F-LCD6 IO3=F-LCD7 IO4=F-LCDE IO5=PG5 IO6=F-LCDRS IO7=PG7
PORTF: designators D6=D6_PORTF D7=D7_PORTF D8=D8_PORTF D9=D9_PORTF D10=D10_PORTF D11=D11_PORTF D12=D12_PORTF D13=D13_PORTF J5=J5_PORTF J6=J6_PORTF LOGO?=LOGO?_PORTF#2 LOGO?=LOGO?_PORTF#1 LOGO?=LOGO?_PORTF#3 R22=R22_PORTF R23=R23_PORTF R24=R24_PORTF R25=R25_PORTF R26=R26_PORTF R27=R27_PORTF R28=R28_PORTF R29=R29_PORTF R30=R30_PORTF R31=R31_PORTF R32=R32_PORTF R33=R33_PORTF R34=R34_PORTF R35=R35_PORTF R36=R36_PORTF R37=R37_PORTF SW9=SW9_PORTF SW10=SW10_PORTF SW11=SW11_PORTF SW12=SW12_PORTF SW13=SW13_PORTF SW14=SW14_PORTF SW15=SW15_PORTF SW16=SW16_PORTF SW17=SW17_PORTF SW18=SW18_PORTF; ports IO0=PF0 IO1=PF1 IO2=PF2 IO3=PF3 IO4=PF4 IO5=PF5 IO6=IO6_PORTF IO7=IO7_PORTF
PORTD: designators D6=D6_PORTD D7=D7_PORTD D8=D8_PORTD D9=D9_PORTD D10=D10_PORTD D11=D11_PORTD D12=D12_PORTD D13=D13_PORTD J5=J5_PORTD J6=J6_PORTD LOGO?=LOGO?_PORTD#2 LOGO?=LOGO?_PORTD#1 LOGO?=LOGO?_PORTD#3 R22=R22_PORTD R23=R23_PORTD R24=R24_PORTD R25=R25_PORTD R26=R26_PORTD R27=R27_PORTD R28=R28_PORTD R29=R29_PORTD R30=R30_PORTD R31=R31_PORTD R32=R32_PORTD R33=R33_PORTD R34=R34_PORTD R35=R35_PORTD R36=R36_PORTD R37=R37_PORTD SW9=SW9_PORTD SW10=SW10_PORTD SW11=SW11_PORTD SW12=SW12_PORTD SW13=SW13_PORTD SW14=SW14_PORTD SW15=SW15_PORTD SW16=SW16_PORTD SW17=SW17_PORTD SW18=SW18_PORTD; ports IO0=PD0 IO1=PD1 IO2=PD2 IO3=PD3 IO4=PD4 IO5=PD5 IO6=PD6 IO7=PD7
PORTE: designators D6=D6_PORTE D7=D7_PORTE D8=D8_PORTE D9=D9_PORTE D10=D10_PORTE D11=D11_PORTE D12=D12_PORTE D13=D13_PORTE J5=J5_PORTE J6=J6_PORTE LOGO?=LOGO?_PORTE#2 LOGO?=LOGO?_PORTE#1 LOGO?=LOGO?_PORTE#3 R22=R22_PORTE R23=R23_PORTE R24=R24_PORTE R25=R25_PORTE R26=R26_PORTE R27=R27_PORTE R28=R28_PORTE R29=R29_PORTE R30=R30_PORTE R31=R31_PORTE R32=R32_PORTE R33=R33_PORTE R34=R34_PORTE R35=R35_PORTE R36=R36_PORTE R37=R37_PORTE SW9=SW9_PORTE SW10=SW10_PORTE SW11=SW11_PORTE SW12=SW12_PORTE SW13=SW13_PORTE SW14=SW14_PORTE SW15=SW15_PORTE SW16=SW16_PORTE SW17=SW17_PORTE SW18=SW18_PORTE; ports IO0=PE0 IO1=PE1 IO2=PE2 IO3=PE3 IO4=PE4 IO5=PE5 IO6=PE6 IO7=PE7
U_PCAL9555IO/PCAL0: designators D6=D6_PCAL0 D7=D7_PCAL0 D8=D8_PCAL0 D9=D9_PCAL0 D10=D10_PCAL0 D11=D11_PCAL0 D12=D12_PCAL0 D13=D13_PCAL0 J5=J5_PCAL0 J6=J6_PCAL0 LOGO?=LOGO?_PCAL0#2 LOGO?=LOGO?_PCAL0#1 LOGO?=LOGO?_PCAL0#3 R22=R22_PCAL0 R23=R23_PCAL0 R24=R24_PCAL0 R25=R25_PCAL0 R26=R26_PCAL0 R27=R27_PCAL0 R28=R28_PCAL0 R29=R29_PCAL0 R30=R30_PCAL0 R31=R31_PCAL0 R32=R32_PCAL0 R33=R33_PCAL0 R34=R34_PCAL0 R35=R35_PCAL0 R36=R36_PCAL0 R37=R37_PCAL0 SW9=SW9_PCAL0 SW10=SW10_PCAL0 SW11=SW11_PCAL0 SW12=SW12_PCAL0 SW13=SW13_PCAL0 SW14=SW14_PCAL0 SW15=SW15_PCAL0 SW16=SW16_PCAL0 SW17=SW17_PCAL0 SW18=SW18_PCAL0; ports IO0=IO0 IO1=IO1 IO2=IO2 IO3=IO3 IO4=IO4 IO5=IO5 IO6=IO6 IO7=IO7
U_PCAL9555IO/PCAL1: designators D6=D6_PCAL1 D7=D7_PCAL1 D8=D8_PCAL1 D9=D9_PCAL1 D10=D10_PCAL1 D11=D11_PCAL1 D12=D12_PCAL1 D13=D13_PCAL1 J5=J5_PCAL1 J6=J6_PCAL1 LOGO?=LOGO?_PCAL1#2 LOGO?=LOGO?_PCAL1#1 LOGO?=LOGO?_PCAL1#3 R22=R22_PCAL1 R23=R23_PCAL1 R24=R24_PCAL1 R25=R25_PCAL1 R26=R26_PCAL1 R27=R27_PCAL1 R28=R28_PCAL1 R29=R29_PCAL1 R30=R30_PCAL1 R31=R31_PCAL1 R32=R32_PCAL1 R33=R33_PCAL1 R34=R34_PCAL1 R35=R35_PCAL1 R36=R36_PCAL1 R37=R37_PCAL1 SW9=SW9_PCAL1 SW10=SW10_PCAL1 SW11=SW11_PCAL1 SW12=SW12_PCAL1 SW13=SW13_PCAL1 SW14=SW14_PCAL1 SW15=SW15_PCAL1 SW16=SW16_PCAL1 SW17=SW17_PCAL1 SW18=SW18_PCAL1; ports IO0=IO0 IO1=IO1 IO2=IO2 IO3=IO3 IO4=IO4 IO5=IO5 IO6=IO6 IO7=IO7

### Notes on the sheet
- (near LOGO?#3) Instruments
- Breakout Board
- (in symbol LOGO-LICENSE-CC) CC
- (in symbol LOGO-LICENSE-CC0-PUBLIC) PUBLIC; 0; DOMAIN
- (in symbol LOGO-SILICONVALLEYGARAGE-SMALL) SILICONVALLEYGARAGE
- (in symbol RESC-0603-4K7-1%-1/10W) 0603
- (in symbol RESC-0603-10K-1%-1/10W) 0603
- (in symbol SWITCH-DIP-NOX8-SMT-2.54) ON

### Library data of the parts
D6-D13 = LED-0603-WHITE: as D5 on sheet AVR64DA64-BREAKOUT; LCSC: C2290; Manufacturer Part Number 1: KT-0603W
J5 = CONN-HEADER-MALE-2X8: CONN,HEADER,2X8,2.54mm; LCSC: C42431826
J6 = CONN-HEADER-MALE-2X10: CONN,HEADER,2X10,2.54mm; LCSC: C5383109
LOGO?#3 = LOGO-SILICONVALLEYGARAGE-SMALL: LOGO,SILICONVALLEYGARAGE,SMALL
R22-R28 = RESC-0603-10K-1%-1/10W: RESISTOR,10K,1%,100mW,0603 (1608); Manufacturer 1: YAGEO; Manufacturer Part Number 1: RC0603FR-0710KL; Power: 1/10W; Location: *; LCSC: C25804; MOUSER: 603-RC0603FR-0710KL; Tolerance: 1%; Value: 10K
R29 = RESC-0603-10K-1%-1/10W: as R17 on sheet AVR64DA64-BREAKOUT; Location: *; LCSC: C25804; MOUSER: 603-RC0603FR-0710KL
R30-R36 = RESC-0603-4K7-1%-1/10W: RESISTOR,4K7,1%,100mW,0603 (1608); Manufacturer 1: YAGEO; Manufacturer Part Number 1: RC0603FR-074K7L; Power: 1/10W; Location: *; LCSC: C23162; MOUSER: 603-RC0603FR-074K7L; Tolerance: 1%; Value: 4K7
R37 = RESC-0603-4K7-1%-1/10W: as R3 on sheet AVR64DA64-BREAKOUT; Location: *; LCSC: C23162; MOUSER: 603-RC0603FR-074K7L
SW9-SW16 = SWITCH-XUNPU-TS-1088-AR02016: as SW6 on sheet AVR64DA64-BREAKOUT; LCSC: C720477; Manufacturer Part Number 1: TS-1088-AR02016
SW17 SW18 = SWITCH-DIP-NOX8-SMT-2.54: SWITCH,DIP,NOX8,SMD,2.54; Manufacturer 1: HanElectricity; Manufacturer Part Number 1: HY-DSIC08LS; LCSC: C319032

## Sheet PCAL9555IO.SchDoc
size A3; SheetNumber: 3; SheetTotal: 3
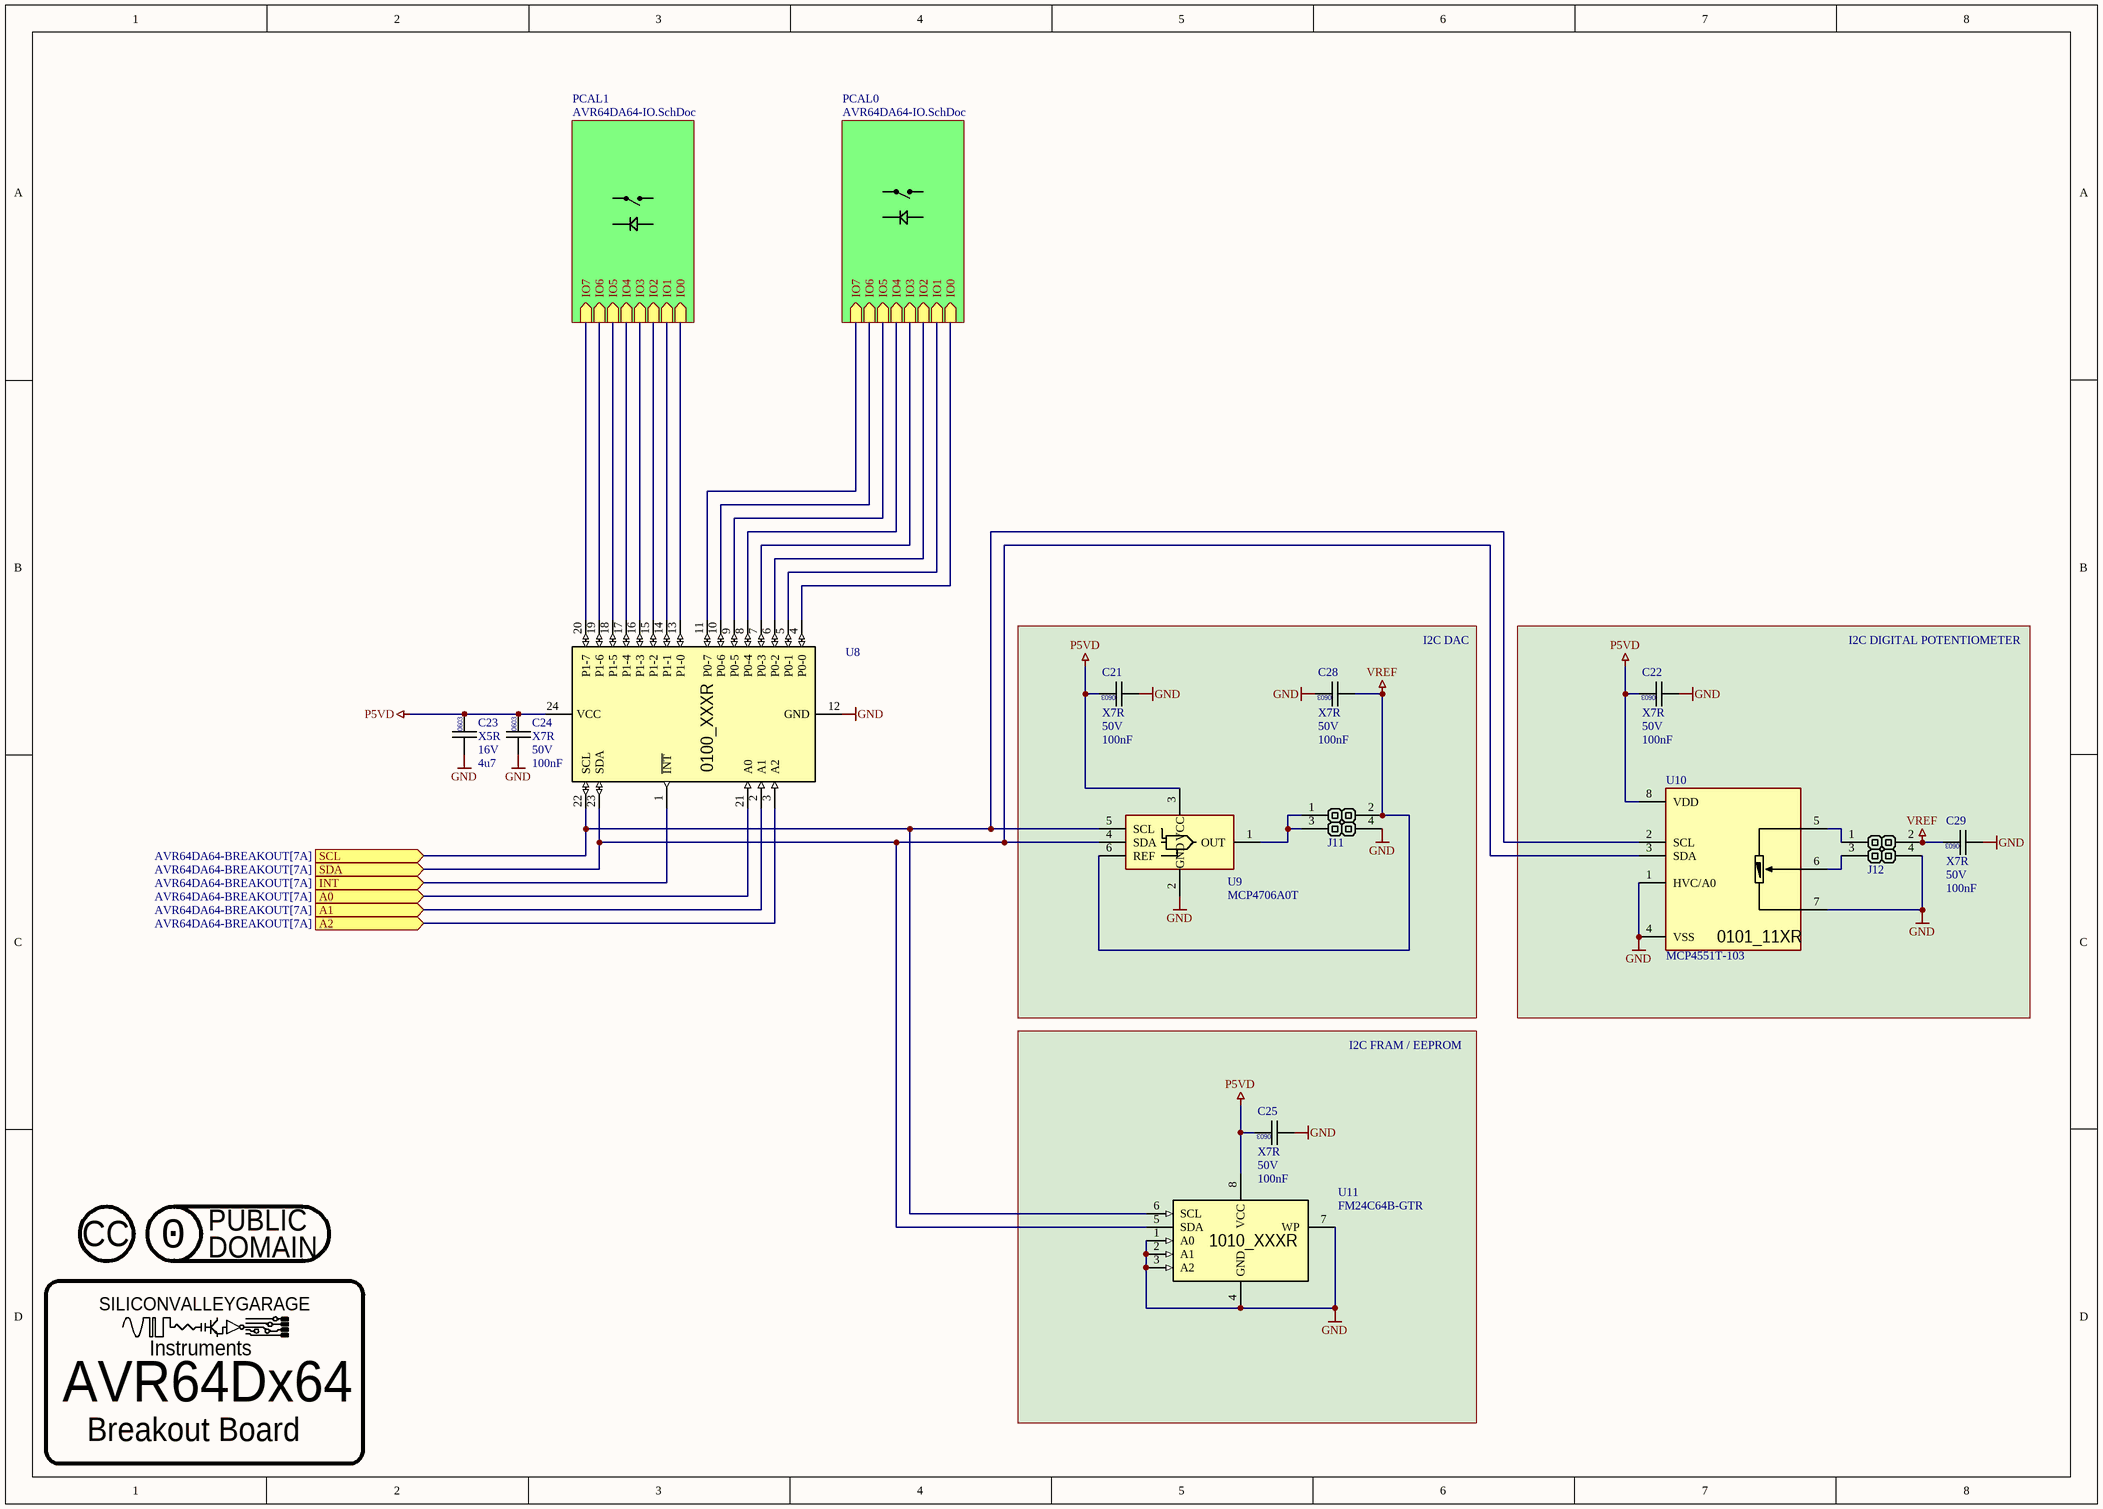
[diagram p3: PCAL9555IO.SchDoc]

### Parts
(Parts that share a designator on the sheet are numbered #1, #2 ... from top to bottom, then left to right.)
C21  Dielectric: X7R  Voltage: 50V  Capacitance: 100nF  [CAPC0603]  (hidden comment: CAP0603)
C22  Dielectric: X7R  Voltage: 50V  Capacitance: 100nF  [CAPC0603]  (hidden comment: CAP0603)
C23  Dielectric: X5R  Voltage: 16V  Capacitance: 4u7  [CAPC0603]  (hidden comment: CAP0603)
C24  Dielectric: X7R  Voltage: 50V  Capacitance: 100nF  [CAPC0603]  (hidden comment: CAP0603)
C25  Dielectric: X7R  Voltage: 50V  Capacitance: 100nF  [CAPC0603]  (hidden comment: CAP0603)
C28  Dielectric: X7R  Voltage: 50V  Capacitance: 100nF  [CAPC0603]  (hidden comment: CAP0603)
C29  Dielectric: X7R  Voltage: 50V  Capacitance: 100nF  [CAPC0603]  (hidden comment: CAP0603)
J11  BOXHEADER-2x2  [CONNECTOR-GENERIC-PINHEADER-2X2]  (value not drawn)
J12  BOXHEADER-2x2  [CONNECTOR-GENERIC-PINHEADER-2X2]  (value not drawn)
LOGO?#4  LOGO-LICENSE-CC  [LOGO-LICENSE-CC]  (value not drawn)  (no BOM)
LOGO?#5  LOGO-LICENSE-CC0-PUBLIC  [LOGO-LICENSE-CC0-PUBLIC]  (value not drawn)  (no BOM)
LOGO?#6  LOGO-SILICONVALLEYGARAGE-SMALL  [SILICONVALLEYGARAGE]  (value not drawn)  (graphical)
U8  PCAL9555  [SO65P640X120-24N]  (value not drawn)
U9  MCP4706A0T  [sot23-6]
U10  MCP4551T-103  [SO65P490-8N]
U11  FM24C64B-GTR  [SO127P600-8N]

### Blocks framed on the sheet
I2C DAC: C21 C28 J11 U9
I2C DIGITAL POTENTIOMETER: C22 C29 J12 U10
I2C FRAM / EEPROM: C25 U11
AVR64Dx64: LOGO?#6

### Sub-sheets
PCAL0 = AVR64DA64-IO.SchDoc: IO0 (in), IO1 (in), IO2 (in), IO3 (in), IO4 (in), IO5 (in), IO6 (in), IO7 (in)
PCAL1 = AVR64DA64-IO.SchDoc: IO0 (in), IO1 (in), IO2 (in), IO3 (in), IO4 (in), IO5 (in), IO6 (in), IO7 (in)

### Ports
A0 (in, see AVR64DA64-BREAKOUT[7A]), A1 (in, see AVR64DA64-BREAKOUT[7A]), A2 (in, see AVR64DA64-BREAKOUT[7A]), INT (in, see AVR64DA64-BREAKOUT[7A]), SCL (in, see AVR64DA64-BREAKOUT[7A]), SDA (in, see AVR64DA64-BREAKOUT[7A])

### Nets
GND: C21.2 C22.2 C23.2 C24.2 C25.2 C28.1 C29.2 J11.4(-) J12.4(-) U8.2(A1) U8.3(A2) U8.12(GND) U8.21(A0) U9.2(GND) U10.1(HVC/A0) U10.4(VSS) U10.7(POB) U11.1(A0) U11.2(A1) U11.3(A2) U11.4(GND) U11.7(WP) ; port A0, port A1, port A2
P5VD: C21.1 C22.1 C23.1 C24.1 C25.1 U8.24(VCC) U9.3(VCC) U10.8(VDD) U11.8(VCC)
VREF: C28.2 C29.1 J11.2(-) J12.2(-) U9.6(REF)
F-SCL: U8.22(SCL) U9.5(SCL) U10.2(SCL) U11.6(SCL) ; port SCL
F-SDA: U8.23(SDA) U9.4(SDA) U10.3(SDA) U11.5(SDA) ; port SDA
IO0: U8.4(P0-0) ; sheet PCAL0/IO0
IO0: U8.13(P1-0) ; sheet PCAL1/IO0  [a separate net that carries the same name]
IO1: U8.14(P1-1) ; sheet PCAL1/IO1
IO1: U8.5(P0-1) ; sheet PCAL0/IO1  [a separate net that carries the same name]
IO2: U8.15(P1-2) ; sheet PCAL1/IO2
IO2: U8.6(P0-2) ; sheet PCAL0/IO2  [a separate net that carries the same name]
IO3: U8.7(P0-3) ; sheet PCAL0/IO3
IO3: U8.16(P1-3) ; sheet PCAL1/IO3  [a separate net that carries the same name]
IO4: U8.8(P0-4) ; sheet PCAL0/IO4
IO4: U8.17(P1-4) ; sheet PCAL1/IO4  [a separate net that carries the same name]
IO5: U8.9(P0-5) ; sheet PCAL0/IO5
IO5: U8.18(P1-5) ; sheet PCAL1/IO5  [a separate net that carries the same name]
IO6: U8.10(P0-6) ; sheet PCAL0/IO6
IO6: U8.19(P1-6) ; sheet PCAL1/IO6  [a separate net that carries the same name]
IO7: U8.11(P0-7) ; sheet PCAL0/IO7
IO7: U8.20(P1-7) ; sheet PCAL1/IO7  [a separate net that carries the same name]
PA7: U8.1(~{INT}) ; port INT
NetJ11_1: J11.1(+) J11.3(-) U9.1(OUT)
NetJ12_1: J12.1(+) U10.5(POA)
NetJ12_3: J12.3(-) U10.6(OW)

### Notes on the sheet
- (near LOGO?#6) Instruments
- Breakout Board
- (in symbol IC-INFINEON-FM24C64B-GTR) 1010_XXXR
- (in symbol IC-MICROCHIP-MCP4551T-103) 0101_11XR
- (in symbol IC-NEXPERIA-PCAL9555A) 0100_XXXR
- (in symbol LOGO-LICENSE-CC) CC
- (in symbol LOGO-LICENSE-CC0-PUBLIC) PUBLIC; 0; DOMAIN
- (in symbol LOGO-SILICONVALLEYGARAGE-SMALL) SILICONVALLEYGARAGE

### Library data of the parts
C21 C22 C24 C25 C28 C29 = CAPC-0603-100nF-50V-X7R: as C2 on sheet AVR64DA64-BREAKOUT; Package / Case: 0603; Location: *; LCSC: C14663; MOUSER: 80-C0603C104K5R
C23 = CAPC-0603-4u7-10V-X5R_1: CAPACITOR,CERAMIC,4u7,16V,X5R,0603; Package / Case: 0603; Location: *; LCSC: C19666
J11 J12 = CONN-HEADER-MALE-2X2: CONN,HEADER,2X2,2.54mm; LCSC: C5383103
LOGO?#6 = LOGO-SILICONVALLEYGARAGE-SMALL: LOGO,SILICONVALLEYGARAGE,SMALL
U8 = IC-NEXPERIA-PCAL9555A: I2C,16BIT AGILE I/O EXPANDER,INT,NEXPERIA,PCAL95555,TSSOP24; Manufacturer Part Number 1: PCAL9555APW,118; DIGIKEY: 568-9928-1-ND; LCSC: C2669740; Manufacturer 1: NEXPERIA
U9 = IC-MICROCHIP-MCP4706A0T: IC,DAC,8BIT,I2C; Manufacturer Part Number 1: MCP4706A0T-E/CH; LCSC: C2649360; Manufacturer 1: MICROCHIP
U10 = IC-MICROCHIP-MCP4551T-103: IC,DIGITAL POTMETER,257STEP,I2C,10K,MICROCHIP,MCP4551T-103; Manufacturer Part Number 1: MCP4551T-103E/MS; LCSC: C627285; DIGIKEY: MCP4551T-103E/MSCT-ND; Manufacturer 1: MICROCHIP
U11 = IC-INFINEON-FM24C64B-GTR: IC,FRAM,I2C, 64KBIT; LCSC: C914923; Supplier 1: Arrow Electronics; Supplier Part Number 1: FM24C64B-GTR

## Nets that join several sheets
GND: AVR64DA64-BREAKOUT (69 pins), PORTA (28 pins), PORTB (28 pins), PORTC (28 pins), PORTG (28 pins), PORTF (28 pins), PORTD (28 pins), PORTE (28 pins), PCAL9555IO (22 pins), U_PCAL9555IO/PCAL0 (28 pins), U_PCAL9555IO/PCAL1 (28 pins)
P5VD: AVR64DA64-BREAKOUT (39 pins), PORTA (8 pins), PORTB (8 pins), PORTC (8 pins), PORTG (8 pins), PORTF (8 pins), PORTD (8 pins), PORTE (8 pins), PCAL9555IO (9 pins), U_PCAL9555IO/PCAL0 (8 pins), U_PCAL9555IO/PCAL1 (8 pins)
VREF: AVR64DA64-BREAKOUT (C27.1 R42.2 R46.1 U12.1), PCAL9555IO (5 pins)
F-LCD4: AVR64DA64-BREAKOUT (DISP1.11 J7.11 U1.52), PORTG (5 pins)
F-LCD5: AVR64DA64-BREAKOUT (DISP1.12 J7.13 U1.53), PORTG (5 pins)
F-LCD6: AVR64DA64-BREAKOUT (DISP1.13 J7.15 U1.54), PORTG (5 pins)
F-LCD7: AVR64DA64-BREAKOUT (DISP1.14 J7.17 U1.55), PORTG (5 pins)
F-LCDE: AVR64DA64-BREAKOUT (DISP1.6 J7.9 U1.58), PORTG (5 pins)
F-LCDRS: AVR64DA64-BREAKOUT (DISP1.4 J7.5 U1.60), PORTG (5 pins)
F-SCL: AVR64DA64-BREAKOUT (5 pins), PORTA (5 pins), PCAL9555IO (U8.22 U9.5 U10.2 U11.6)
F-SDA: AVR64DA64-BREAKOUT (5 pins), PORTA (5 pins), PCAL9555IO (U8.23 U9.4 U10.3 U11.5)
IO0: PCAL9555IO (U8.4), U_PCAL9555IO/PCAL0 (5 pins)
IO0: PCAL9555IO (U8.13), U_PCAL9555IO/PCAL1 (5 pins)
IO1: PCAL9555IO (U8.14), U_PCAL9555IO/PCAL1 (5 pins)
IO1: PCAL9555IO (U8.5), U_PCAL9555IO/PCAL0 (5 pins)
IO2: PCAL9555IO (U8.15), U_PCAL9555IO/PCAL1 (5 pins)
IO2: PCAL9555IO (U8.6), U_PCAL9555IO/PCAL0 (5 pins)
IO3: PCAL9555IO (U8.7), U_PCAL9555IO/PCAL0 (5 pins)
IO3: PCAL9555IO (U8.16), U_PCAL9555IO/PCAL1 (5 pins)
IO4: PCAL9555IO (U8.8), U_PCAL9555IO/PCAL0 (5 pins)
IO4: PCAL9555IO (U8.17), U_PCAL9555IO/PCAL1 (5 pins)
IO5: PCAL9555IO (U8.9), U_PCAL9555IO/PCAL0 (5 pins)
IO5: PCAL9555IO (U8.18), U_PCAL9555IO/PCAL1 (5 pins)
IO6: PCAL9555IO (U8.10), U_PCAL9555IO/PCAL0 (5 pins)
IO6: PCAL9555IO (U8.19), U_PCAL9555IO/PCAL1 (5 pins)
IO7: PCAL9555IO (U8.11), U_PCAL9555IO/PCAL0 (5 pins)
IO7: PCAL9555IO (U8.20), U_PCAL9555IO/PCAL1 (5 pins)
PA4: AVR64DA64-BREAKOUT (R9.2 SW1.1 U1.2), PORTA (5 pins)
PA5: AVR64DA64-BREAKOUT (U1.3 U7.4), PORTA (5 pins)
PA6: AVR64DA64-BREAKOUT (U1.4 U7.6), PORTA (5 pins)
PA7: AVR64DA64-BREAKOUT (U1.5), PORTA (5 pins), PCAL9555IO (U8.1)
PB0: AVR64DA64-BREAKOUT (U1.8), PORTB (5 pins)
PB1: AVR64DA64-BREAKOUT (U1.9), PORTB (5 pins)
PB4: AVR64DA64-BREAKOUT (U1.12), PORTB (5 pins)
PB5: AVR64DA64-BREAKOUT (U1.13), PORTB (5 pins)
PB6: AVR64DA64-BREAKOUT (U1.14), PORTB (5 pins)
PB7: AVR64DA64-BREAKOUT (U1.15), PORTB (5 pins)
PC0: AVR64DA64-BREAKOUT (U1.16), PORTC (5 pins)
PC1: AVR64DA64-BREAKOUT (U1.17), PORTC (5 pins)
PC2: AVR64DA64-BREAKOUT (U1.18), PORTC (5 pins)
PC3: AVR64DA64-BREAKOUT (U1.19), PORTC (5 pins)
PC4: AVR64DA64-BREAKOUT (U1.22), PORTC (5 pins)
PC5: AVR64DA64-BREAKOUT (U1.23), PORTC (5 pins)
PC6: AVR64DA64-BREAKOUT (U1.24), PORTC (5 pins)
PC7: AVR64DA64-BREAKOUT (U1.25), PORTC (5 pins)
PD0: AVR64DA64-BREAKOUT (U1.26), PORTD (5 pins)
PD1: AVR64DA64-BREAKOUT (U1.27), PORTD (5 pins)
PD2: AVR64DA64-BREAKOUT (U1.28), PORTD (5 pins)
PD3: AVR64DA64-BREAKOUT (U1.29), PORTD (5 pins)
PD4: AVR64DA64-BREAKOUT (U1.30), PORTD (5 pins)
PD5: AVR64DA64-BREAKOUT (U1.31), PORTD (5 pins)
PD6: AVR64DA64-BREAKOUT (U1.32), PORTD (5 pins)
PD7: AVR64DA64-BREAKOUT (R47.1), PORTD (5 pins)
PE0: AVR64DA64-BREAKOUT (U1.36), PORTE (5 pins)
PE1: AVR64DA64-BREAKOUT (U1.37), PORTE (5 pins)
PE2: AVR64DA64-BREAKOUT (U1.38), PORTE (5 pins)
PE3: AVR64DA64-BREAKOUT (U1.39), PORTE (5 pins)
PE4: AVR64DA64-BREAKOUT (U1.40), PORTE (5 pins)
PE5: AVR64DA64-BREAKOUT (U1.41), PORTE (5 pins)
PE6: AVR64DA64-BREAKOUT (U1.42), PORTE (5 pins)
PE7: AVR64DA64-BREAKOUT (U1.43), PORTE (5 pins)
PF0: AVR64DA64-BREAKOUT (U1.44), PORTF (5 pins)
PF1: AVR64DA64-BREAKOUT (U1.45), PORTF (5 pins)
PF2: AVR64DA64-BREAKOUT (U1.46), PORTF (5 pins)
PF3: AVR64DA64-BREAKOUT (U1.47), PORTF (5 pins)
PF4: AVR64DA64-BREAKOUT (U1.48), PORTF (5 pins)
PF5: AVR64DA64-BREAKOUT (U1.49), PORTF (5 pins)
PG5: AVR64DA64-BREAKOUT (U1.59), PORTG (5 pins)
PG7: AVR64DA64-BREAKOUT (U1.61), PORTG (5 pins)
SCL2: AVR64DA64-BREAKOUT (8 pins), PORTB (10 pins)

## Assembly variants
AVR64DA64-BREAKOUT-JLCPCB: not fitted DISP1 J1 J2 J3 J4 J5_PCAL0 J5_PCAL1 J5_PORTA J5_PORTB J5_PORTC J5_PORTD J5_PORTE J5_PORTF J5_PORTG J6_PCAL0 J6_PCAL1 J6_PORTA J6_PORTB J6_PORTC J6_PORTD J6_PORTE J6_PORTF J6_PORTG J7 J8 J11 J12 J14 J15 R38 R46 SW1 U9 U10 U11 U12